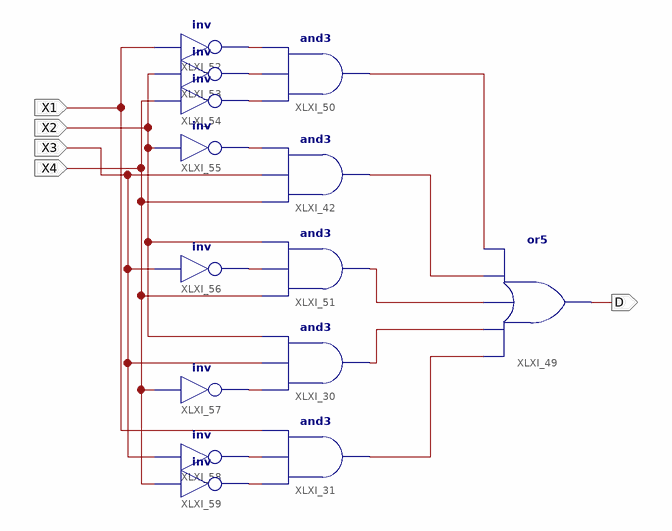
[diagram p0: schematic sheet 1]
// Xilinx ISE schematic bin7seg_d.sch (spartan3e) as structural Verilog: 14 symbols, 5 ports
module bin7seg_d (
  input  X1,
  input  X2,
  input  X3,
  input  X4,
  output D
);

  wire XLXN_8, XLXN_9, XLXN_12, XLXN_14, XLXN_44, XLXN_45, XLXN_46, XLXN_47, XLXN_48, XLXN_49, XLXN_50,
       XLXN_51, XLXN_52;

  and XLXI_31 (XLXN_44, XLXN_52, XLXN_51, X1);
  and XLXI_30 (XLXN_14, XLXN_50, X3, X2);
  and XLXI_42 (XLXN_9, X4, X3, XLXN_48);
  or XLXI_49 (D, XLXN_44, XLXN_14, XLXN_12, XLXN_9, XLXN_8);
  and XLXI_50 (XLXN_8, XLXN_47, XLXN_46, XLXN_45);
  and XLXI_51 (XLXN_12, X4, XLXN_49, X2);
  not XLXI_52 (XLXN_45, X1);
  not XLXI_53 (XLXN_46, X2);
  not XLXI_54 (XLXN_47, X4);
  not XLXI_55 (XLXN_48, X2);
  not XLXI_56 (XLXN_49, X3);
  not XLXI_57 (XLXN_50, X4);
  not XLXI_58 (XLXN_51, X3);
  not XLXI_59 (XLXN_52, X4);
endmodule
